# EAGLE schematic open_bioband_V1.1 (EAGLE 8.0.0)
COMPANY: ADAFRUIT INDUSTRIES; DRAWN: KTOWN; REV: B
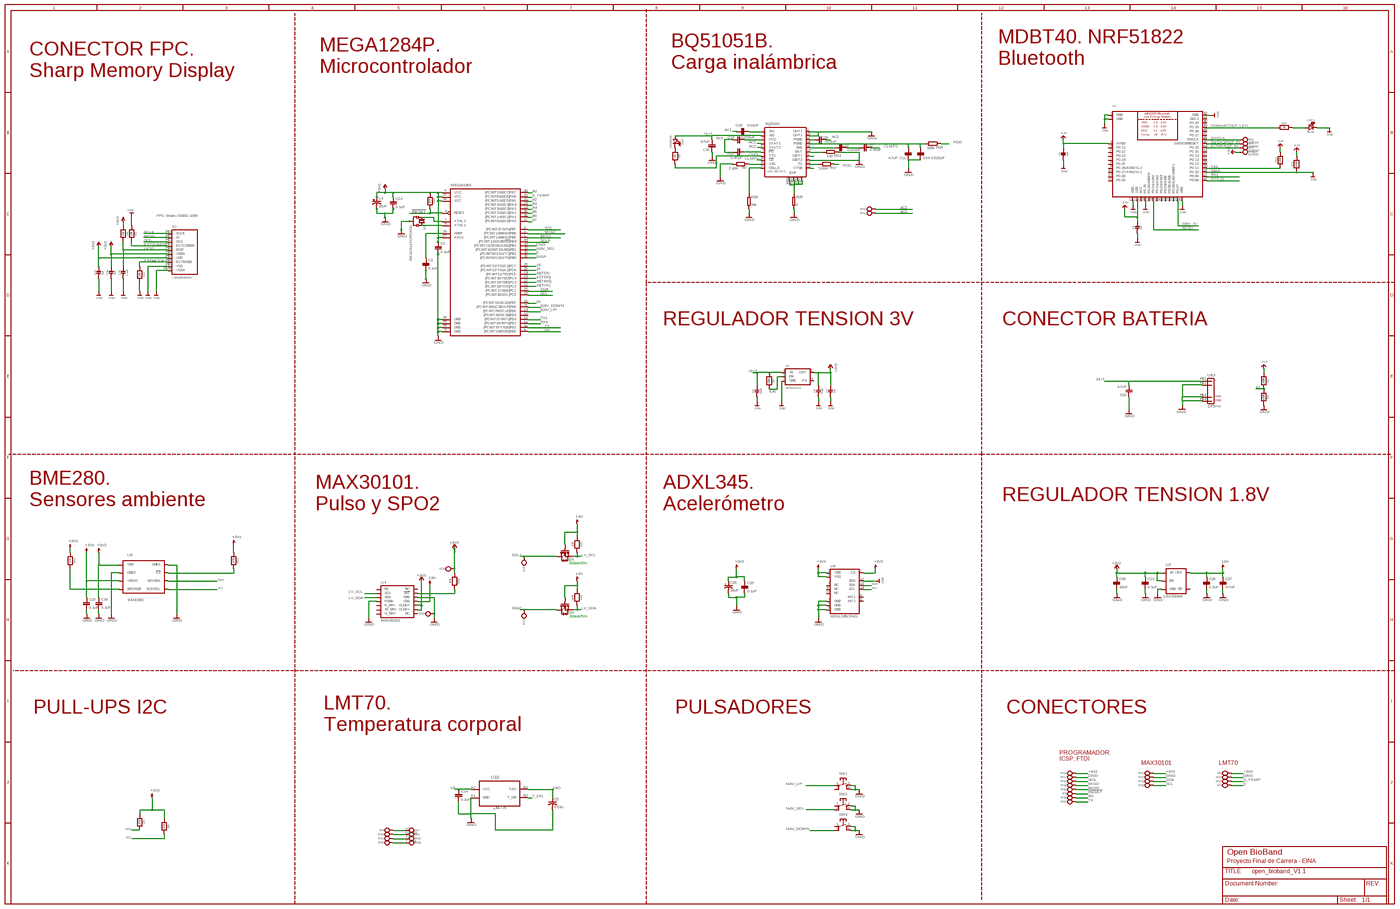
[diagram p0: schematic, sheet 1, overview]
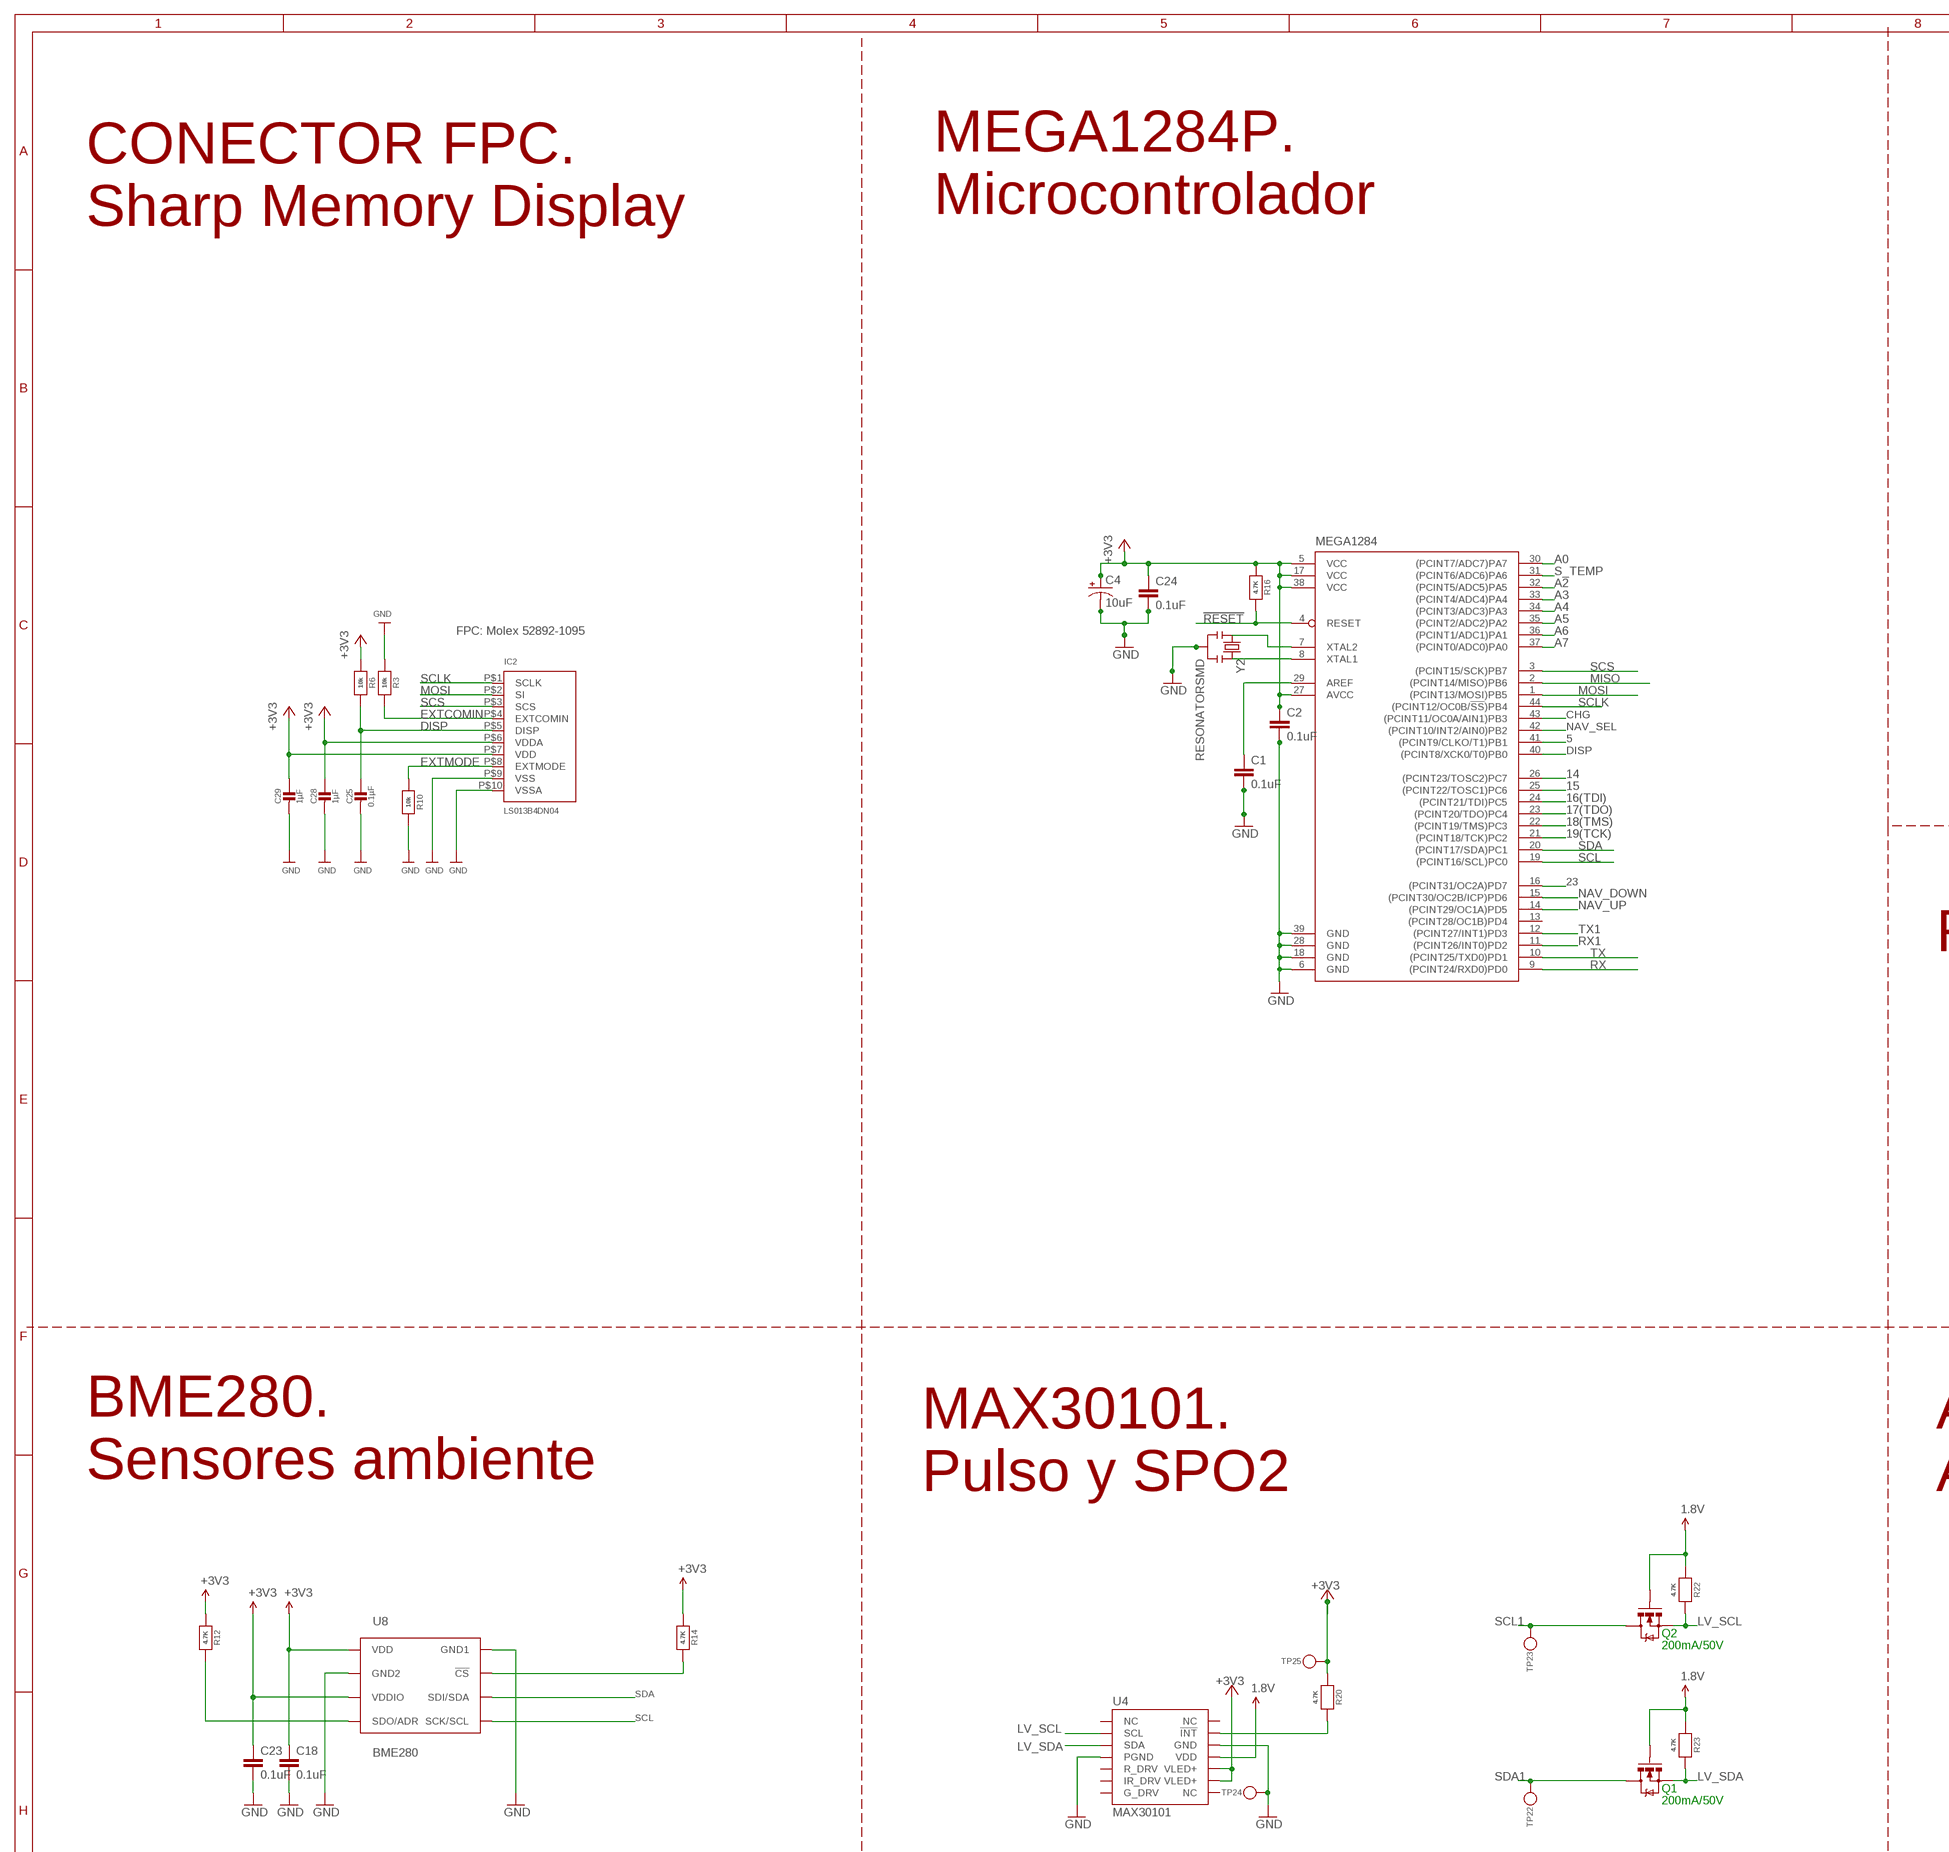
[diagram p1: schematic, sheet 1, part 1 of 4]
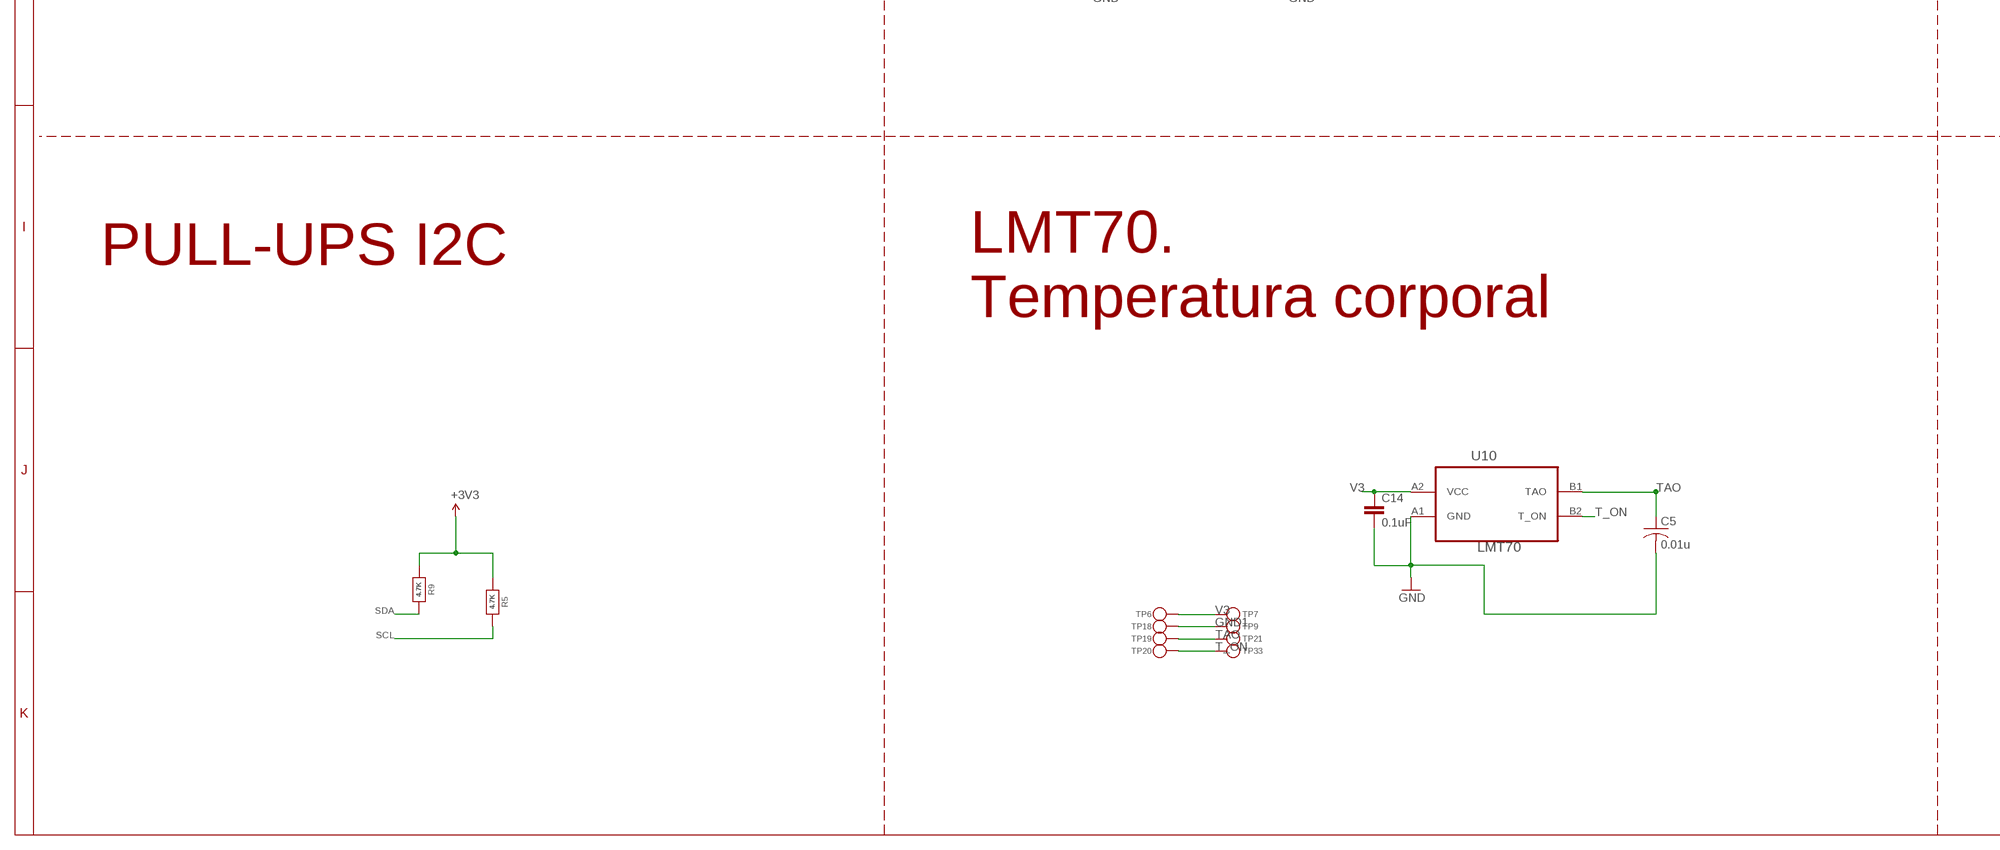
[diagram p2: schematic, sheet 1, part 2 of 4]
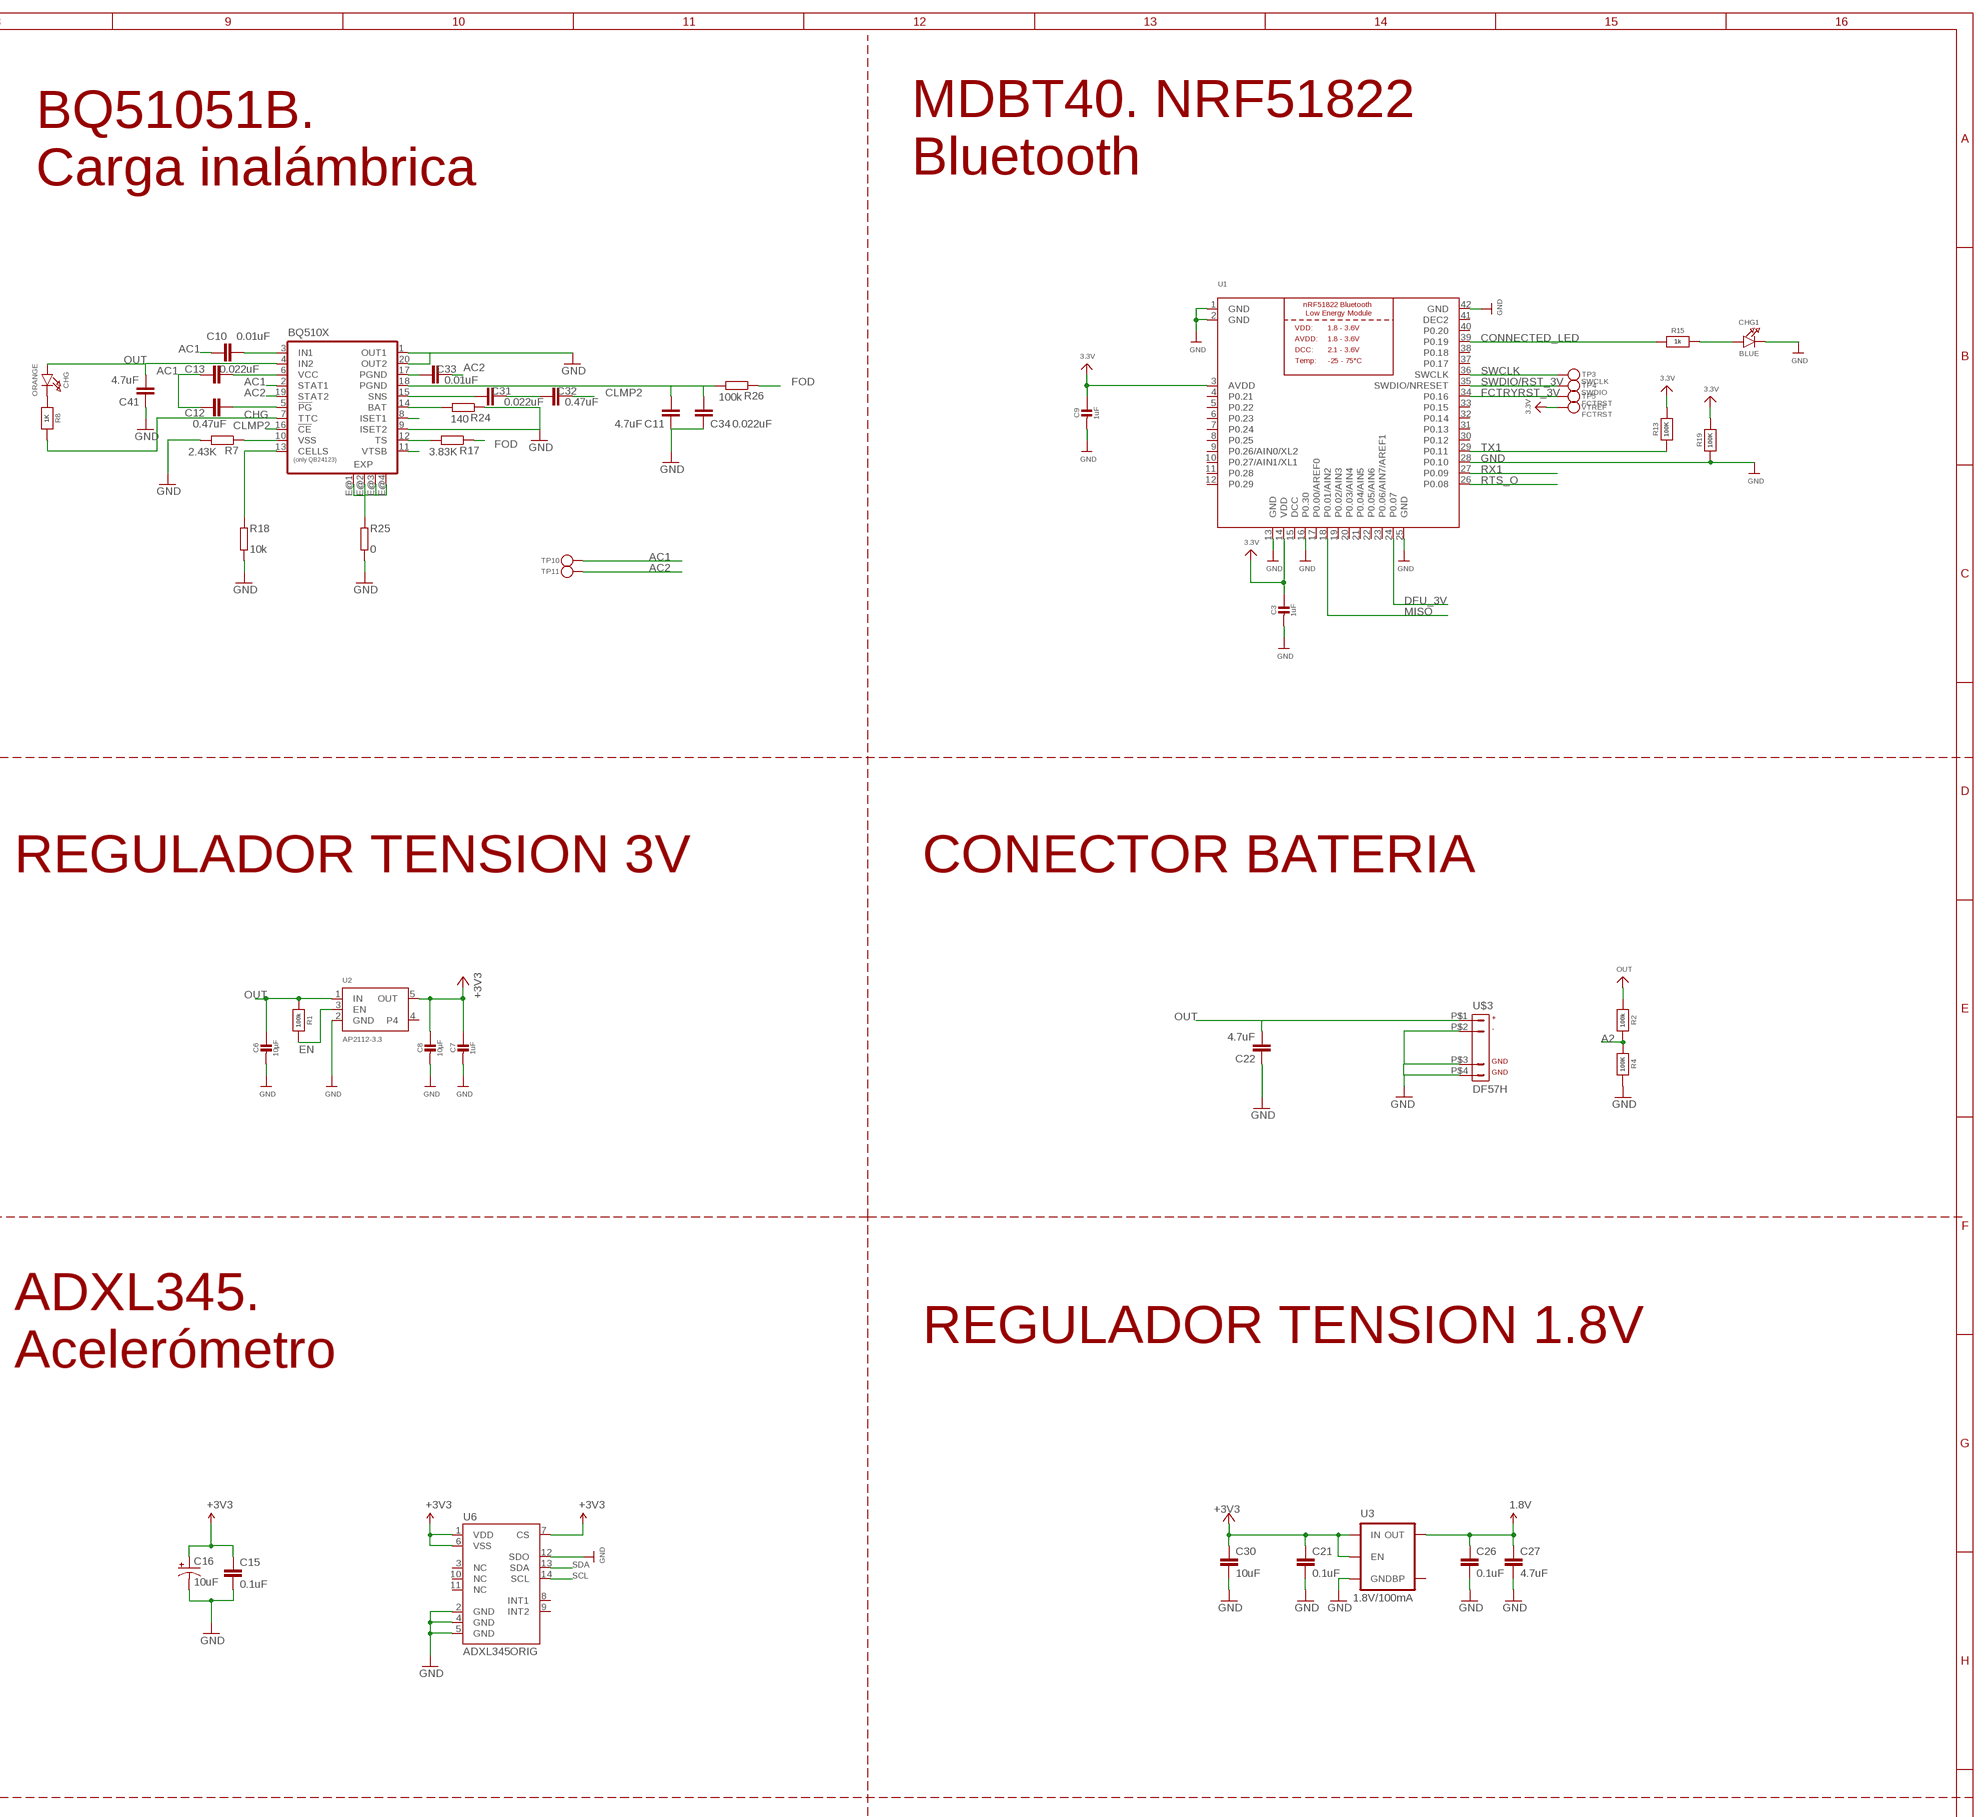
[diagram p3: schematic, sheet 1, part 3 of 4]
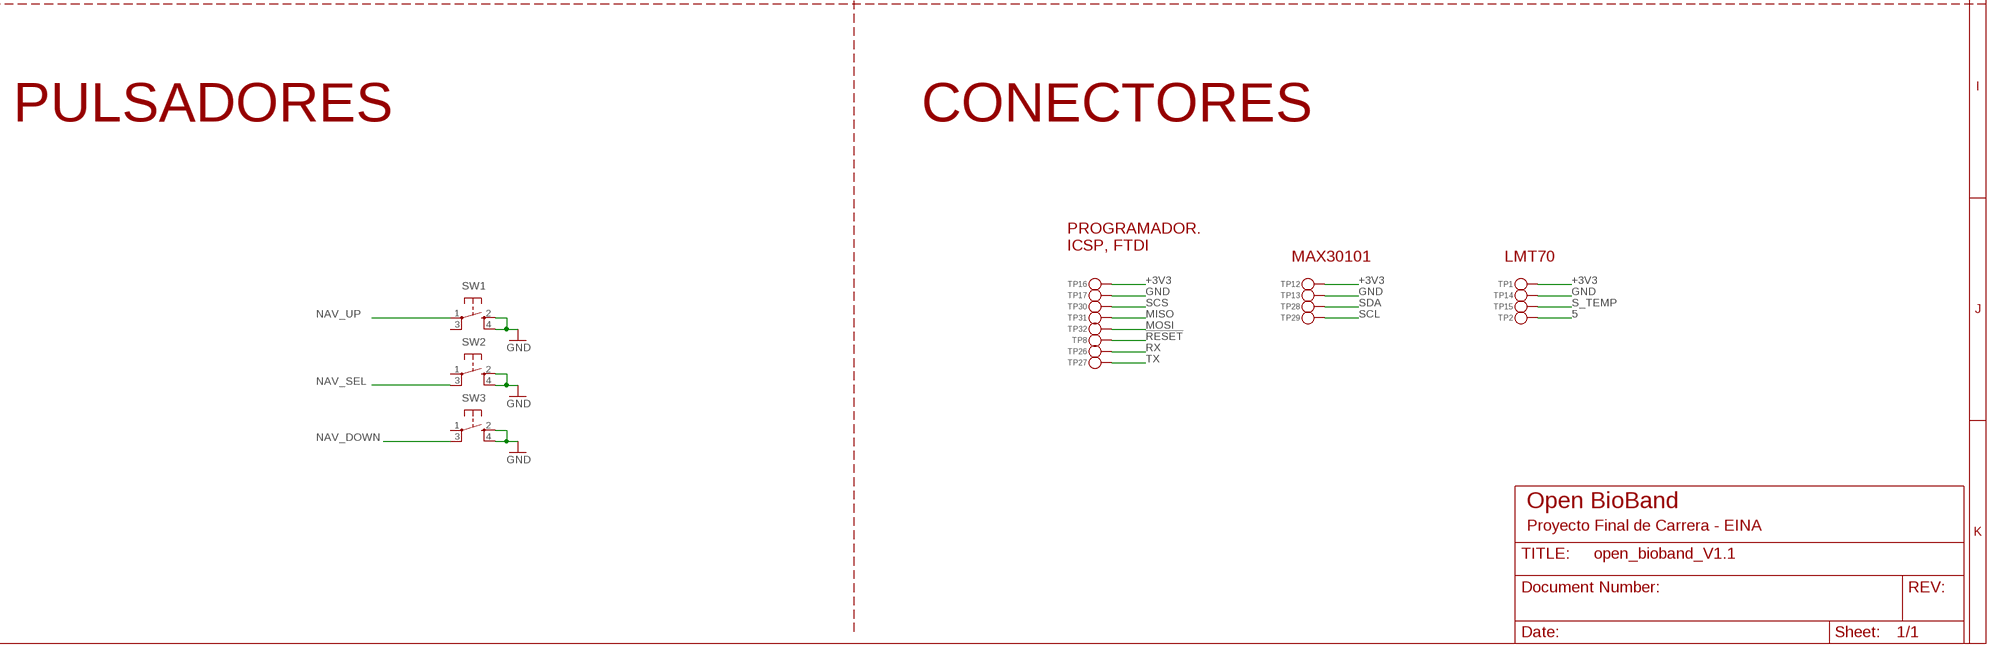
[diagram p4: schematic, sheet 1, part 4 of 4]

## Parts
BQ510X  BQ24120  [R-PQFP-N20]
C1  0.1uF  CAP0402-CAP  [0402-CAP]
C2  0.1uF  CAP0402-CAP  [0402-CAP]
C3  1uF  CAP_CERAMIC_0402  [_0402]
C4  10uF  CAP_POL1206  [EIA3216]
C5  0.01u  C-USC0402  [C0402]
C6  10µF  CAP_CERAMIC_0402  [_0402]
C7  1uF  CAP_CERAMIC_0402  [_0402]
C8  10µF  CAP_CERAMIC_0402  [_0402]
C9  1uF  CAP_CERAMIC_0402  [_0402]
C10  0.01uF  C-EUC0402_LIBELIUM  [C0402_LIBELIUM]
C11  4.7uF  C-EUC0402_LIBELIUM  [C0402_LIBELIUM]
C12  0.47uF  C-EUC0402_LIBELIUM  [C0402_LIBELIUM]
C13  0.022uF  C-EUC0402_LIBELIUM  [C0402_LIBELIUM]
C14  0.1uF  0.1UF-0402-16V-10%  [0402]
C15  0.1uF  CAP0402-CAP  [0402-CAP]
C16  10uF  CAP_POL1206  [EIA3216]
C18  0.1uF  CAP0402-CAP  [0402-CAP]
C21  0.1uF  CAP0402-CAP  [0402-CAP]
C22  4.7uF  C-EUC0402  [C0402]
C23  0.1uF  CAP0402-CAP  [0402-CAP]
C24  0.1uF  CAP0402-CAP  [0402-CAP]
C25  0.1µF  CAP_CERAMIC_0402  [_0402]
C26  0.1uF  CAP0402-CAP  [0402-CAP]
C27  4.7uF  CAP0402-CAP  [0402-CAP]
C28  1µF  CAP_CERAMIC_0402  [_0402]
C29  1µF  CAP_CERAMIC_0402  [_0402]
C30  10uF  CAP0402-CAP  [0402-CAP]
C31  0.022uF  C-EUC0402_LIBELIUM  [C0402_LIBELIUM]
C32  0.47uF  C-EUC0402_LIBELIUM  [C0402_LIBELIUM]
C33  0.01uF  C-EUC0402_LIBELIUM  [C0402_LIBELIUM]
C34  0.022uF  C-EUC0402_LIBELIUM  [C0402_LIBELIUM]
C41  4.7uF  C-EUC0402_LIBELIUM  [C0402_LIBELIUM]
CHG  ORANGE  LED0603  [CHIPLED_0603]
CHG1  BLUE  LED0603  [CHIPLED_0603]
IC2  LS013B4DN04  SHARP_MEMORYLCD_10PIN  [FPC_10PIN_52892-1095]
MEGA1284  ATMEGA644A  [TQFP44]
Q1  200mA/50V  MOSFET-NCHANNELBSS138  [SOT23-3]
Q2  200mA/50V  MOSFET-NCHANNELBSS138  [SOT23-3]
R1  100k  RESISTOR_0402  [_0402]
R2  100k  RESISTOR_0402  [_0402]
R3  10k  RESISTOR_0402  [_0402]
R4  100K  RESISTOR_0402  [_0402]
R5  4.7K  RESISTOR_0402  [_0402]
R6  10k  RESISTOR_0402  [_0402]
R7  2.43K  R-EU_R0402_LIBELIUM  [R0402_LIBELIUM]
R8  1K  RESISTOR_0402  [_0402]
R9  4.7K  RESISTOR_0402  [_0402]
R10  10k  RESISTOR_0402  [_0402]
R12  4.7K  RESISTOR_0402  [_0402]
R13  100K  RESISTOR_0402  [_0402]
R14  4.7K  RESISTOR_0402  [_0402]
R15  1k  RESISTOR_0402  [_0402]
R16  4.7K  RESISTOR_0402  [_0402]
R17  3.83K  R-EU_R0402_LIBELIUM  [R0402_LIBELIUM]
R18  10k  R-EU_R0402_LIBELIUM  [R0402_LIBELIUM]
R19  100K  RESISTOR_0402  [_0402]
R20  4.7K  RESISTOR_0402  [_0402]
R22  4.7K  RESISTOR_0402  [_0402]
R23  4.7K  RESISTOR_0402  [_0402]
R24  140  R-EU_R0402_LIBELIUM  [R0402_LIBELIUM]
R25  0  R-EU_R0402_LIBELIUM  [R0402_LIBELIUM]
R26  100k  R-EU_R0402_LIBELIUM  [R0402_LIBELIUM]
SW1  SPST_TACTRA  [TACT_SMD2]
SW2  SPST_TACTRA  [TACT_SMD2]
SW3  SPST_TACTRA  [TACT_SMD2]
TP1  TESTPOINTROUND1MM  [TESTPOINT_ROUND_1MM]
TP2  TESTPOINTROUND1MM  [TESTPOINT_ROUND_1MM]
TP3  SWCLK  TESTPOINTPAD1MM  [TESTPOINT_PAD_1MM]
TP4  SWDIO  TESTPOINTPAD1MM  [TESTPOINT_PAD_1MM]
TP5  FCTRST  TESTPOINTPAD1MM  [TESTPOINT_PAD_1MM]
TP6  TESTPOINT0.1"  [1X01_ROUND]
TP7  TESTPOINTPAD2MM  [TESTPOINT_PAD_2MM]
TP8  TESTPOINT0.1"  [1X01_ROUND]
TP9  TESTPOINTPAD2MM  [TESTPOINT_PAD_2MM]
TP10  TESTPOINT0.1"  [1X01_ROUND]
TP11  TESTPOINT0.1"  [1X01_ROUND]
TP12  TESTPOINT0.1"  [1X01_ROUND]
TP13  TESTPOINT0.1"  [1X01_ROUND]
TP14  TESTPOINTROUND1MM  [TESTPOINT_ROUND_1MM]
TP15  TESTPOINTROUND1MM  [TESTPOINT_ROUND_1MM]
TP16  TESTPOINT0.1"  [1X01_ROUND]
TP17  TESTPOINT0.1"  [1X01_ROUND]
TP18  TESTPOINT0.1"  [1X01_ROUND]
TP19  TESTPOINT0.1"  [1X01_ROUND]
TP20  TESTPOINT0.1"  [1X01_ROUND]
TP21  TESTPOINTPAD2MM  [TESTPOINT_PAD_2MM]
TP22  TESTPOINT0.1"  [1X01_ROUND]
TP23  TESTPOINT0.1"  [1X01_ROUND]
TP24  TESTPOINT0.1"  [1X01_ROUND]
TP25  TESTPOINT0.1"  [1X01_ROUND]
TP26  TESTPOINT0.1"  [1X01_ROUND]
TP27  TESTPOINT0.1"  [1X01_ROUND]
TP28  TESTPOINT0.1"  [1X01_ROUND]
TP29  TESTPOINT0.1"  [1X01_ROUND]
TP30  TESTPOINT0.1"  [1X01_ROUND]
TP31  TESTPOINT0.1"  [1X01_ROUND]
TP32  TESTPOINT0.1"  [1X01_ROUND]
TP33  TESTPOINTPAD2MM  [TESTPOINT_PAD_2MM]
U1  NRF51822_MODULE_MDBT40  [BLE_MODULE_RAYTAC_MDBT40]
U2  AP2112-3.3  VREG_SOT23-5  [SOT23-5]
U3  1.8V/100mA  V_REG_SP62141.8V  [SC70]
U4  MAX30101  MAX30105SMD  [OLGA-14]
U6  ADXL345ORIG  [LGA14]
U8  BME280  [BME280_LGA]
U10  LMT70LMT70  [BGA4C40P2X2_77X77X50]
U$3  DF57H  [DF57H-2P]
VTREF  FCTRST  TESTPOINTPAD1MM  [TESTPOINT_PAD_1MM]
Y2  RESONATORSMD  [RESONATOR-SMD]

## Nets
1.8V: C26.1 C27.1 Q1.1(G) Q2.1(G) R22.1 R23.1 U3.5(OUT) U4.11(VDD)
5: MEGA1284.41((PCINT9/CLKO/T1)PB1) TP2.P$1
14: MEGA1284.26((PCINT23/TOSC2)PC7)
15: MEGA1284.25((PCINT22/TOSC1)PC6)
16(TDI): MEGA1284.24((PCINT21/TDI)PC5)
17(TDO): MEGA1284.23((PCINT20/TDO)PC4)
18(TMS): MEGA1284.22((PCINT19/TMS)PC3)
19(TCK): MEGA1284.21((PCINT18/TCK)PC2)
23: MEGA1284.16((PCINT31/OC2A)PD7)
!CS: R14.2 U8.P$2(!CS)
!INT: R20.2 U4.13(!INT)
!RESET: MEGA1284.4(RESET) R16.2 TP8.1
+3V3: C2.1 C3.1 C4.A(+) C7.1 C8.1 C9.1 C15.1 C16.A(+) C18.1 C23.1 C24.1 C28.1 C29.1 IC2.P$6(VDDA) IC2.P$7(VDD) MEGA1284.5(VCC) MEGA1284.17(VCC) MEGA1284.27(AVCC) MEGA1284.38(VCC) R5.1 R6.1 R9.1 R12.1 R13.2 R14.1 R16.1 R19.2 TP1.P$1 TP12.1 TP16.1 U1.3(AVDD) U1.14(VDD) U2.5(OUT) U6.1(VDD) U6.6(VSS) U6.7(CS) U8.P$6(VDDIO) U8.P$8(VDD) VTREF.P$1 ; supply symbol labelled 3.3V
+3V31: C21.1 C30.1 R20.1 TP25.1 U3.1(IN) U3.3(EN) U4.9(VLED+) U4.10(VLED+) ; supply symbol labelled +3V3
A0: MEGA1284.30((PCINT7/ADC7)PA7)
A2: MEGA1284.32((PCINT5/ADC5)PA5) R2.2 R4.1
A3: MEGA1284.33((PCINT4/ADC4)PA4)
A4: MEGA1284.34((PCINT3/ADC3)PA3)
A5: MEGA1284.35((PCINT2/ADC2)PA2)
A6: MEGA1284.36((PCINT1/ADC1)PA1)
A7: MEGA1284.37((PCINT0/ADC0)PA0)
AC1: BQ510X.2(STAT1) C10.1 C12.1 C13.1 TP10.1
AC2: BQ510X.19(STAT2) C31.2 C32.1 C33.2 TP11.1
AREF: C1.1 MEGA1284.29(AREF)
BOOT3: BQ510X.3(IN1) C10.2
CHG: BQ510X.7(TTC) MEGA1284.43((PCINT11/OC0A/AIN1)PB3) R8.2
CLMP2: BQ510X.16(!CE) C32.2
CONNECTED_LED: R15.1 U1.39(P0.19)
DFU_3V: U1.24(P0.07)
DISP: C25.1 IC2.P$5(DISP) MEGA1284.40((PCINT8/XCK0/T0)PB0) R6.2
EN: R1.2 U2.3(EN)
EXTCOMIN: IC2.P$4(EXTCOMIN) R3.2
EXTMODE: IC2.P$8(EXTMODE) R10.1
FCTRYRST_3V: TP5.P$1 U1.34(P0.16)
FOD: BQ510X.14(BAT) R17.1 R24.2 R26.1
GND: BQ510X.1(OUT1) BQ510X.9(ISET2) BQ510X.20(OUT2) C1.2 C2.2 C3.2 C4.C(-) C6.2 C7.2 C8.2 C9.2 C11.1 C15.2 C16.C(-) C18.2 C22.1 C23.2 C24.2 C25.2 C28.2 C29.2 C34.1 C41.1 CHG1.C IC2.P$9(VSS) IC2.P$10(VSSA) MEGA1284.6(GND) MEGA1284.18(GND) MEGA1284.28(GND) MEGA1284.39(GND) R3.1 R4.2 R7.2 R10.2 R18.2 R19.1 R24.1 R25.2 SW1.2(S) SW1.4(S1) SW2.2(S) SW2.4(S1) SW3.2(S) SW3.4(S1) TP13.1 TP14.P$1 TP17.1 U1.1(GND) U1.2(GND) U1.13(GND) U1.16(P0.30) U1.25(GND) U1.28(P0.10) U1.42(GND) U2.2(GND) U6.2(GND) U6.4(GND) U6.5(GND) U6.12(SDO) U8.P$1(GND1) U8.P$7(GND2) U$3.P$2 U$3.P$3 U$3.P$4 Y2.2
GND1: C5.2 C14.2 C21.2 C26.2 C27.2 C30.2 TP9.P$1 TP18.1 TP24.1 U3.2(GND) U4.4(PGND) U4.12(GND) U10.A1(GND) ; supply symbol labelled GND
LV_SCL: Q2.2(S) R22.2 U4.2(SCL)
LV_SDA: Q1.2(S) R23.2 U4.3(SDA)
MISO: MEGA1284.2((PCINT14/MISO)PB6) TP31.1 U1.18(P0.01/AIN2)
MOSI: IC2.P$2(SI) MEGA1284.1((PCINT13/MOSI)PB5) TP32.1
N$1: CHG.C R8.1
N$2: MEGA1284.7(XTAL2) Y2.1
N$6: CHG1.A R15.2
N$9: MEGA1284.8(XTAL1) Y2.3
N$14: BQ510X.6(VCC) C13.2
N$15: BQ510X.5(!PG) C12.2
N$19: BQ510X.10(VSS) R7.1
N$21: BQ510X.17(PGND) C33.1
N$23: BQ510X.18(PGND) C11.2 C34.2 R26.2
N$24: BQ510X.15(SNS) C31.1
N$25: BQ510X.8(ISET1)
N$26: BQ510X.12(TS) R17.2
N$27: BQ510X.11(VTSB)
N$28: BQ510X.E@1(EXP) BQ510X.E@2(EXP) BQ510X.E@3(EXP) BQ510X.E@4(EXP) R25.1
NAV_DOWN: MEGA1284.15((PCINT30/OC2B/ICP)PD6) SW3.3(P1)
NAV_SEL: MEGA1284.42((PCINT10/INT2/AIN0)PB2) SW2.3(P1)
NAV_UP: MEGA1284.14((PCINT29/OC1A)PD5) SW1.1(P)
OUT: BQ510X.4(IN2) C6.1 C22.2 C41.2 CHG.A R1.1 R2.1 U2.1(IN) U$3.P$1
P0.5: BQ510X.13(CELLS) R18.1
RTS_O: U1.26(P0.08)
RX: MEGA1284.9((PCINT24/RXD0)PD0) TP26.1
RX1: MEGA1284.11((PCINT26/INT0)PD2) U1.27(P0.09)
S_TEMP: MEGA1284.31((PCINT6/ADC6)PA6) TP15.P$1
SCL: MEGA1284.19((PCINT16/SCL)PC0) R5.2 TP29.1 U6.14(SCL) U8.P$4(SCK/SCL)
SCL1: Q2.3(D) TP23.1
SCLK: IC2.P$1(SCLK) MEGA1284.44((PCINT12/OC0B/!SS!)PB4)
SCS: IC2.P$3(SCS) MEGA1284.3((PCINT15/SCK)PB7) TP30.1
SDA: MEGA1284.20((PCINT17/SDA)PC1) R9.2 TP28.1 U6.13(SDA) U8.P$3(SDI/SDA)
SDA1: Q1.3(D) TP22.1
SDO/ADR: R12.2 U8.P$5(SDO/ADR)
SWCLK: TP3.P$1 U1.36(SWCLK)
SWDIO/RST_3V: TP4.P$1 U1.35(SWDIO/NRESET)
T_ON: TP20.1 TP33.P$1 U10.B2(T_ON)
TAO: C5.1 TP19.1 TP21.P$1 U10.B1(TAO)
TX: MEGA1284.10((PCINT25/TXD0)PD1) TP27.1
TX1: MEGA1284.12((PCINT27/INT1)PD3) R13.1 U1.29(P0.11)
V3: C14.1 TP6.1 TP7.P$1 U10.A2(VCC)
Unconnected: MEGA1284.13((PCINT28/OC1B)PD4) SW1.3(P1) SW2.1(P) SW3.1(P) U1.4(P0.21) U1.5(P0.22) U1.6(P0.23) U1.7(P0.24) U1.8(P0.25) U1.9(P0.26/AIN0/XL2) U1.10(P0.27/AIN1/XL1) U1.11(P0.28) U1.12(P0.29) U1.17(P0.00/AREF0) U1.19(P0.02/AIN3) U1.20(P0.03/AIN4) U1.21(P0.04/AIN5) U1.22(P0.05/AIN6) U1.23(P0.06/AIN7/AREF1) U1.30(P0.12) U1.31(P0.13) U1.32(P0.14) U1.33(P0.15) U1.37(P0.17) U1.38(P0.18) U1.40(P0.20) U2.4 U3.4(BP) U4.1(NC) U4.5(R_DRV) U4.6(IR_DRV) U4.7(G_DRV) U4.8(NC) U4.14(NC) U6.3(NC) U6.8(INT1) U6.9(INT2) U6.10(NC) U6.11(NC)

## Notes on the sheet
- MDBT40. NRF51822
  Bluetooth
- BQ51051B.
  Carga inalámbrica
- MEGA1284P.
  Microcontrolador
- CONECTOR FPC.
  Sharp Memory Display
- FPC: Molex 52892-1095
- REGULADOR TENSION 3V | CONECTOR BATERIA
- BME280.
  Sensores ambiente
- MAX30101.
  Pulso y SPO2
- ADXL345.
  Acelerómetro
- REGULADOR TENSION 1.8V
- LMT70. 
  Temperatura corporal
- PULL-UPS I2C | PULSADORES | CONECTORES
- PROGRAMADOR. 
  ICSP, FTDI
- MAX30101 | LMT70
- Open BioBand
- Proyecto Final de Carrera - EINA

## Power pins joined to a net without a drawn wire
DCC: U1.15(DCC)
DEC2: U1.41(DEC2)

## Library data of the parts
BQ510X = texas_2:BQ2412*: SINGLE-CHIP SWITCHMODE, LI-ION AND LI-POLYMER CHARGE-MANAGEMENT WITH ENHANCED EMI PERFORMANCE(bqSWITCHER TM) Source: http://focus.ti.com/lit/ds/symlink/bq24120.pdf
C1 C2 C18 C23 C24 = microduino:CAP: Capacitor Standard 0603 ceramic capacitor, and 0.1" leaded capacitor.
C3 C6-C9 C25 C28 C29 = microbuilder:CAP_CERAMIC: Ceramic Capacitors For new designs, use the packages preceded by an '_' character since they are more reliable: The following footprints should be used on most boards: _0402 - Standard footprint for regular board layouts _0603 - Standard footprint for regular board layouts _0805 - Standard footprint for regular board layouts _1206 - Standard footprint for regular board layouts For extremely tight-pitch boards where space is at a premium, the following 'micro-pitch' footprints can be used (smaller pads, no silkscreen outline, etc.): _0402MP - Micro-pitch footprint for very dense/compact boards _0603MP - Micro-pitch footprint for very dense/compact boards _0805MP - Micro-pitch footprint for very dense/compact boards _1206MP - Micro-pitch footprint for very dense/compact boards
C4 = microduino:CAP_POL: Capacitor Polarized These are standard SMD and PTH capacitors. Normally 10uF, 47uF, and 100uF in electrolytic and tantalum varieties. Always verify the external diameter of the through hole cap, it varies with capacity, voltage, and manufacturer. The EIA devices should be standard.
C5 = adafruit:C-US: CAPACITOR, American symbol
C10-C13 C31-C34 C41 = libelium:C-EU: CAPACITOR, European symbol
C14 = SparkFun-Capacitors:0.1UF: 0.1µF ceramic capacitors A capacitor is a passive two-terminal electrical component used to store electrical energy temporarily in an electric field.; PROD_ID: CAP-12416
C15 = SparkFun:CAP: Capacitor Standard 0603 ceramic capacitor, and 0.1" leaded capacitor.
C16 = SparkFun:CAP_POL: Capacitor Polarized These are standard SMD and PTH capacitors. Normally 10uF, 47uF, and 100uF in electrolytic and tantalum varieties. Always verify the external diameter of the through hole cap, it varies with capacity, voltage, and manufacturer. The EIA devices should be standard.
C21 C26 C27 C30 = SparkFun-Capacitors:CAP: Capacitor Standard 0603 ceramic capacitor, and 0.1" leaded capacitor.
C22 = rcl:C-EU: CAPACITOR, European symbol
CHG CHG1 = microbuilder:LED: LED 0603 - 0603 Surface Mount Package 2mA: Green LED - Low Power (3.9mcd, 2ma, 1.7Vf) - Digikey: 475-2709-2-ND Orange LED - Low Power (9.8mcd, 2ma, 1.8Vf) - Digikey: 475-1194-2-ND Red LED - Low Power (5mcd, 2ma, 1.8Vf) - Digikey: 475-1195-2-ND Yellow LED - Low Power (7mcd, 2ma, 1.8Vf) - Digikey: 475-1196-2-ND 5mA: Blue LED - Low Power (17mcd, 5ma, 2.9Vf) - Digikey: LNJ937W8CRACT-ND 0805 - 0805 Surface Mount Package 2mA: Red LED (8.8mcd, 2mA, 1.8Vf, Clear) - Low Power [Digikey: 475-2510-1-ND] Green LED (5mcd, 2mA, 1.8Vf, Clear) - Low Power [Digikey: 475-2730-1-ND] Yellow LED (11.3mcd, 2mA, 1.8Vf, Clear) - Low Power [Digikey: 475-2555-1-ND] 20mA: Red LED (104mcd, 20mA, Diffused) - LS R976 [Digikey: 475-1278-6-ND] Red LED (12mcd, 20mA, 2.0Vf, Clear) - APT2012EC [Digikey: 754-1128-1-ND] Green LED (15mcd, 20mA, 2.2Vf, Clear) - APT2012GC [Digikey: 754-1131-1-ND] Orange LED (160mcd, 20mA, 2.1Vf, Clear) - APT2012SECK [Digikey: 754-1130-1-ND] 1206 - 1206 Surface Mount Package Green LED (26mcd, 20mA, Diffused) - LG N971 [Digikey: 475-1407-6-ND] Red LED (15mcd, 20mA, Diffused) - LH N974 [Digikey: 475-1416-6-ND] Cree - Cree High-Power Surface Mount LEDs XPEBWT-L1-0000-00D50 - White 111lm 350mA 2.9Vf 6200K 110° XTEAWT-00-0000-00000LEE3 - White 114lm 350mA 2.85Vf 5000K 115° Everlight - Everlight 45-21 Series Surface Mount LEDs 45-21/QK2C-B2832AC2CB2/2T - Warm White 2000mcd 20mA 3.25Vf 3050K 120° 45-21/LK2C-B38452C4CB2/2T - Nuetral White 2000mcd 20mA 3.25Vf 4150K 120° 45-21/LK2C-B50634C6CB2/2T - Cold White 2200mcd 20mA 3.25Vf 5650K 120° PLCC2 Reverse Mount LS T77K-J1L2-1-0-2-R18-Z - Red 11.25mcd 2mA 1.8Vf 630nm 120° LO T77K-L1M2-24-Z - Orange 19.6mcd 2mA 1.8Vf 606nm 120° LY T77K-K2M1-26-Z - Yellow 15.7mcd 2mA 1.8Vf 587nm 120°
IC2 = microbuilder:SHARP_MEMORYLCD_10PIN: Sharp Mono Memory LCD LS013B4DN02 - 1.35" 96x96 Pixels LS027B7DH01 - 2.7" 400x240 Pixels
MEGA1284 = atmel:ATMEGA644: 8-bit Microcontroller with 64K Bytes In-System Programmable Flash Source: http://www.atmel.com/dyn/resources/prod_documents/doc2593.pdf; OC_FARNELL: 1455123; OC_NEWARK: 58M3748
Q1 Q2 = SparkFun-DiscreteSemi:MOSFET-NCHANNEL: Common NMOSFET Parts MFG P/N Store ID Prod ID FDD8780 TRANS-09984 SI7820DN TRANS-11055 FDS6630A IC-08089 2N7002PW TRANS-11151 FQP30N06L COM-10213 TRANS-10060 BSS123LT1G TRANS-08345 BSS138 TRANS-00830 BS170 2N7000; PROD_ID: TRANS-00830
R1-R6 R8-R10 R12-R16 R19 R20 R22 R23 = microbuilder:RESISTOR: Resistors For new designs, use the packages preceded by an '_' character since they are more reliable: The following footprints should be used on most boards: _0402 - Standard footprint for regular board layouts _0603 - Standard footprint for regular board layouts _0805 - Standard footprint for regular board layouts _1206 - Standard footprint for regular board layouts For extremely tight-pitch boards where space is at a premium, the following 'micro-pitch' footprints can be used (smaller pads, no silkscreen outline, etc.): _0402MP - Micro-pitch footprint for very dense/compact boards _0603MP - Micro-pitch footprint for very dense/compact boards _0805MP - Micro-pitch footprint for very dense/compact boards _1206MP - Micro-pitch footprint for very dense/compact boards
R7 R17 R18 R24-R26 = libelium:R-EU_: RESISTOR, European symbol
SW1-SW3 = zak:SPST_TACT
TP1-TP5 TP7 TP9 TP14 TP15 TP21 TP33 VTREF = microbuilder:TESTPOINT: Test Point Various test points for characterisation and PCB testing TESTPOINT_SMT - Compact Surface Mount Test Point [Digikey: 5016KTR-ND]
TP6 TP8 TP10-TP13 TP16-TP20 TP22-TP32 = microbuilder:TESTPOINT: Test Point Various test points for characterisation and PCB testing TESTPOINT_SMT - Compact Surface Mount Test Point [Digikey: 5016KTR-ND]; BOM: EXCLUDE
U1 = microbuilder:NRF51822_MODULE_MDBT40: nRF51822 Bluetooth Low Energy Module
U2 = microbuilder:VREG_SOT23-5: SOT23-5 Fixed Voltage Regulators Part Current Out V Out V In V Dropout θJA (°C/W) TJ (°C) Digikey Part No. ADP121 150mA 3.3V 3.4-5.5V 0.09V @ 150mA -- -- ADP121-AUJZ33R7CT-ND ADP121 150mA 3.0V 3.1-5.5V 0.09V @ 150mA -- -- ADP121-AUJZ30R7CT-ND ADP122 300mA 3.3V 3.4-5.5V 0.085V @ 300mA -- -- ADP122AUJZ-3.3-R7CT-ND ADP1712 300mA 3.3V 3.5-5.5V 0.17V @ 300mA -- -- ADP1712AUJZ-3.3-R7TR-ND AP7311 (Low Cost) 150mA 3.3V 3.5-6V 0.15V @ 150mA -- -- AP7311-33WG-7DICT-ND LD39015M18R 150mA 1.8V 1.9V-5.5V 0.08V @ 100mA -- -- 497-6977-1-ND LP2985A-33DBVR 150mA 3.3V 3.3-16V 0.28V @ 150mA 206 150 296-18479-1-ND MCP1824T-3302E/OT 300mA 3.3V 3.5V-6V 0.2V @ 300mA -- -- MCP1824T-3302E/OTCT-ND MIC5205-2.5YM5 TR 150mA 2.5V 2.7-16V 0.165V @ 150mA -- -- 576-1257-2-ND MIC5205-3.0YM5 TR 150mA 3.0V 3.2V-16V 0.165V @ 150mA -- -- 576-1258-2-ND MIC5205-3.3YM5 TR 150mA 3.3V 3.5V-16V 0.165V @ 150mA -- -- 576-1259-2-ND TPS780330220 150mA 3.3V+2.2V 3.6-5.5V 250mV Max -- -- 296-23332-1-ND TDA3663/N1,135 100mA 3.3V 3.5-45V 0.18V @ 50mA -- -- 568-5343-1-ND Max operating temp can be calculated using θJA, TJ (max junction temperature), and power in watts. Set the "Maximum Ambient Temperature" until it reaches TJ ("Max Junction Temperature"), which is the absolute limit for safe use of the regulator: Heat Sink Temperature Calculator <http://www.daycounter.com/Calculators/Heat-Sink-Temperature-Calculator.phtml> For example, With 12V source into a 3.3V LP2985 and a 30mA load, we are dissipating (12V-3.3V) * 0.03A = 0.261W. With a θJA of 206 °C/W, a TJ of 150°C, and 261mW we can safely use the chip without a heat sink up to 75°C (=147.1°C Junction Temperature).
U3 = SparkFun-PowerIC:V_REG_SP6214; PROD_ID: VREG-08428
U4 = SparkFun-Sensors:MAX30105: Description: Particle Detection IC. Primarily used for smoke detection, can be used for Pulse Detection, Pulse Ox, and possible visual particle detection.; PROD_ID: IC-13510; VALUE: MAX30105
U6 = Testing:ADXL345
U8 = BME280ComponentLibrary:BME280; PROD_ID: IC-13090
U10 = LMT70:LMT70: LOW-POWER SINGLE INVERTER GATE; MPN: LMT70; OC_FARNELL: -; OC_NEWARK: 50R7866; PACKAGE: BGA-4; SUPPLIER: Texas Instruments
U$3 = onomo:DF57H
Y2 = microduino:RESONATOR: Resonator Small SMD resonator. This is the itty bitty 10/20MHz resonators with built in caps. CSTCE10M0G55 and CSTCE20M0V53. Footprint has been reviewed closely but hasn't been tested yet.

## Net classes
1 power: width 0.203 mm